# EAGLE design shell_2 (EAGLE 6.6.0)
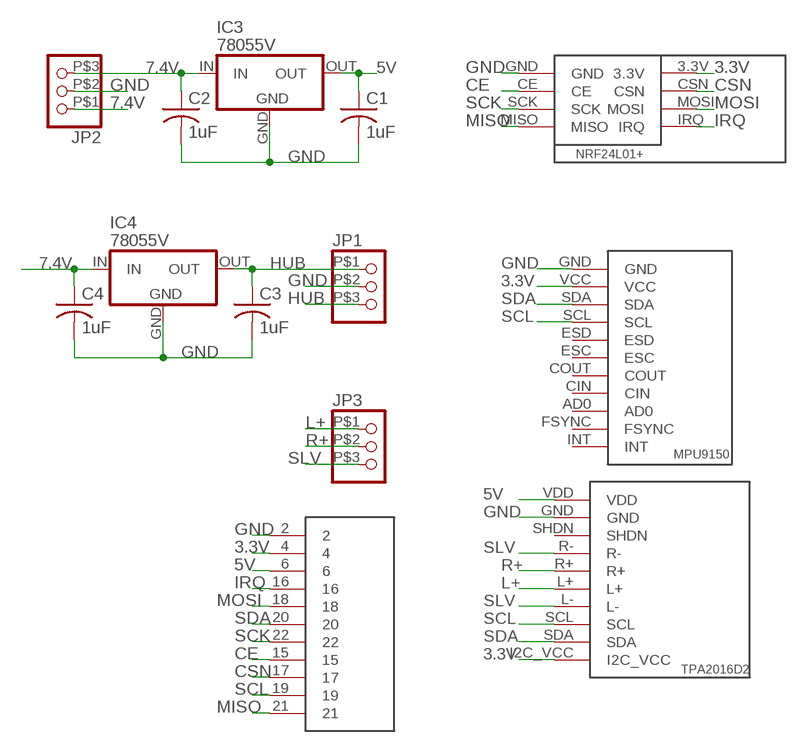
[diagram p0: schematic, sheet 1]

## Parts
C1  1uF  C-US050-024X044  [C050-024X044]
C2  1uF  C-US050-024X044  [C050-024X044]
C3  1uF  C-US050-024X044  [C050-024X044]
C4  1uF  C-US050-024X044  [C050-024X044]
IC3  78055V  [TO220H]
IC4  78055V  [TO220H]
JP1  PINHD-1X3SMD  [1X3/90SMD]
JP2  PINHD-1X3SMD  [1X3/90SMD]
JP3  PINHD-1X3SMD  [1X3/90SMD]
JP4  PINHD-1X11SMD  [1X11/90_2]
U$1  MPU9150  [MPU9150]
U$2  NRF24L01  [NRF24L01]
U$3  TPA2016D2  [TPA2016D2]

## Nets
3.3V: JP4.4 U$1.VCC U$2.3.3V U$3.I2C_VCC
5V: C1.1 IC3.OUT JP4.6 U$3.VDD
7.4V: C2.1 C4.1 IC3.IN IC4.IN JP2.P$1 JP2.P$3
CE: JP4.15 U$2.CE
CSN: JP4.17 U$2.CSN
GND: C1.2 C2.2 C3.2 C4.2 IC3.GND IC4.GND JP1.P$2 JP2.P$2 JP4.2 U$1.GND U$2.GND U$3.GND
HUB: C3.1 IC4.OUT JP1.P$1 JP1.P$3
IRQ: JP4.16 U$2.IRQ
L+: JP3.P$1 U$3.L+
MISO: JP4.21 U$2.MISO
MOSI: JP4.18 U$2.MOSI
R+: JP3.P$2 U$3.R+
SCK: JP4.22 U$2.SCK
SCL: JP4.19 U$1.SCL U$3.SCL
SDA: JP4.20 U$1.SDA U$3.SDA
SLV: JP3.P$3 U$3.L- U$3.R-
Unconnected: U$1.AD0 U$1.CIN U$1.COUT U$1.ESC U$1.ESD U$1.FSYNC U$1.INT U$3.SHDN

## Library data of the parts
C1-C4 = rcl:C-US: CAPACITOR, American symbol
IC3 IC4 = apro:78*: Positive VOLTAGE REGULATOR Source: http://cache.national.com/ds/LM/LM78L05.pdf http://www.fairchildsemi.com/ds/LM/LM7805.pdf
JP1-JP3 = apro:PINHD-1X3: PIN HEADER
JP4 = apro:PINHD-1X11: PIN HEADER
U$1 = apro:MPU9150
U$2 = apro:NRF24L01
U$3 = apro:TPA2016D2

## Board
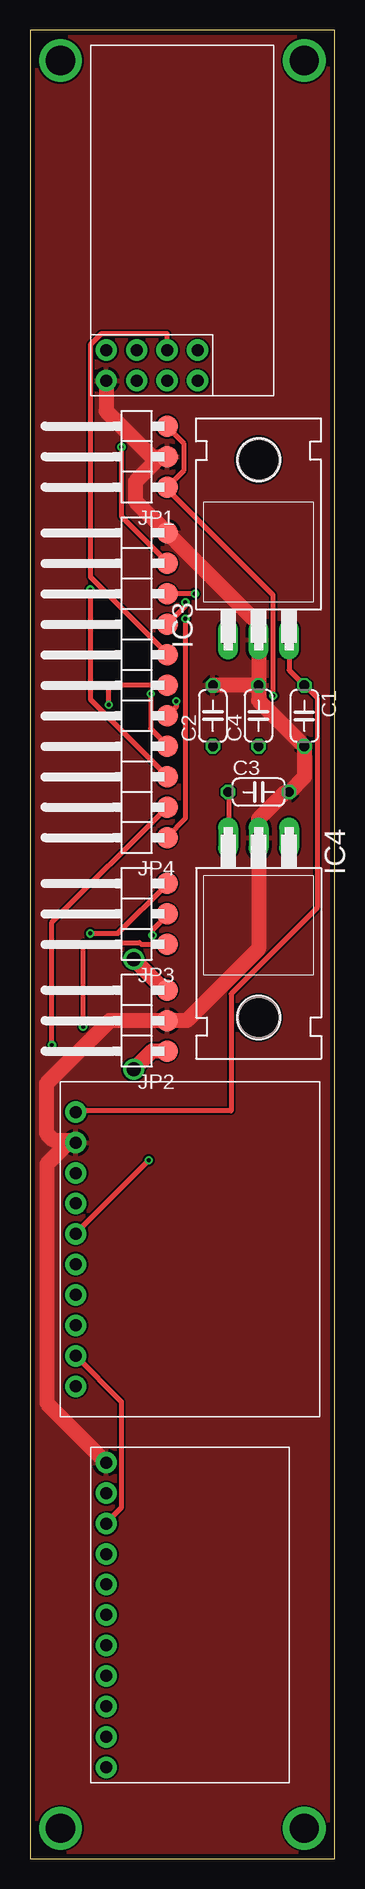
[diagram p1: board, top side]
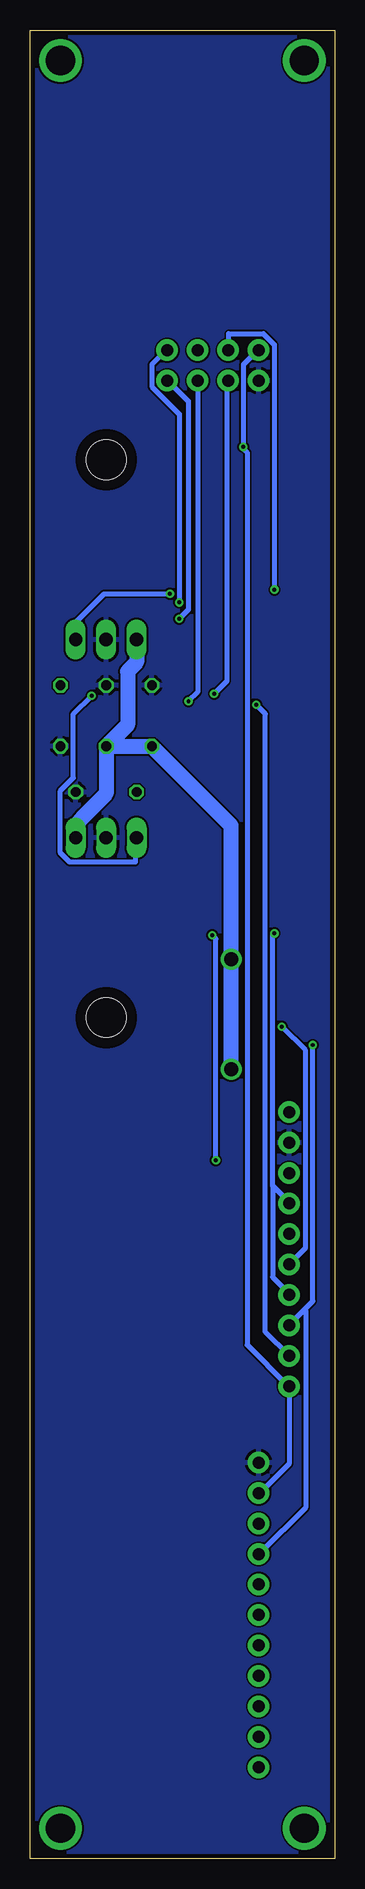
[diagram p2: board, bottom side, seen from below]

Size 25.4 x 152.4 mm. Coordinates in mm from the lower left corner, seen from the top.
Outline: 0,0 25.4,0 25.4,152.4 0,152.4 0,0
Copper layers (1*16): Top 0.0356mm / dielectric 1.5011mm / Bottom 0.0356mm
Design rules "LaenPCBOrder *": minimum track width 16mil, minimum drill 13mil, track to track 6mil, track to pad 6mil, pad to pad 6mil, via to via 6mil, smd to smd 6mil, copper to edge 15mil, drill to drill 6mil, minimum pad ring 7mil, minimum via ring 7mil, stop-mask expansion 3mil, vias tented up to drill 0mil, thermal gap 10mil

### Footprints (pad centres in the part's own frame; a part is rotated, then mirrored left to right if it is on the bottom)
C050-024X044 = drill 0.813 octagon: 1 -2.54,0; 2 2.54,0
TO220H = drill 1.118 long: GND 0,-10.16; IN -2.54,-10.16; OUT 2.54,-10.16 | hole 3.302: 0,4.826
1X3/90SMD = smd 1.778 x 1.778: P$1 -2.54,-2.54; P$2 0,-2.54; P$3 2.54,-2.54
1X11/90_2 = smd 1.778 x 1.778: 2 11.43,-2.54; 4 8.89,-2.54; 6 6.35,-2.54; 15 -6.35,-2.54; 16 3.81,-2.54; 17 -8.89,-2.54; 18 1.27,-2.54; 19 -11.43,-2.54; 20 -1.27,-2.54; 21 -13.97,-2.54; 22 -3.81,-2.54
MPU9150 = drill 1 pad 1.778: AD0 -7.62,-7.62; CIN -7.62,-5.08; COUT -7.62,-2.54; ESC -7.62,0; ESD -7.62,2.54; FSYNC -7.62,-10.16; GND -7.62,12.7; INT -7.62,-12.7; SCL -7.62,5.08; SDA -7.62,7.62; VCC -7.62,10.16
NRF24L01 = drill 1 pad 1.778: 3.3V 1.27,3.81; CE -1.27,1.27; CSN 1.27,1.27; GND -1.27,3.81; IRQ 1.27,-3.81; MISO -1.27,-3.81; MOSI 1.27,-1.27; SCK -1.27,-1.27
TPA2016D2 = drill 1 pad 1.778: GND -10.16,8.89; I2C_VCC -10.16,-11.43; L+ -10.16,-1.27; L- -10.16,-3.81; R+ -10.16,1.27; R- -10.16,3.81; SCL -10.16,-6.35; SDA -10.16,-8.89; SHDN -10.16,6.35; VDD -10.16,11.43

### Placement (x,y rotation side)
C1  22.86,95.25 270 top
C2  15.24,95.25 90 top
C3  19.05,88.9 0 top
C4  19.05,95.25 90 top
IC3  19.05,111.76 0 top
IC4  19.05,74.93 180 top
JP1  8.89,116.84 90 top
JP2  8.89,69.85 90 top
JP3  8.89,78.74 90 top
JP4  8.89,99.06 90 top
U$1  13.97,20.32 0 top
U$2  10.16,124.46 90 top
U$3  13.97,50.8 0 top

### Tracks (layer width: path | path; a pad name or v marks a point on that pad's centre or on a via)
3.3V  (via drill 0.33)
  Top 0.406: v7.62,117.65 7.62,111.86 11.43,108.05 JP4.4
  Bottom 0.406: U$1.VCC 6.25,30.48 3.81,32.92 U$3.I2C_VCC 3.96,39.47 7.32,42.82 7.32,117.2 7.62,117.5 v7.62,117.65 7.62,124.51 6.4,125.73 U$2.3.3V
5V  (via drill 0.33 pad 0.69)
  Top 0.406: IC3.OUT 21.59,99.06 C1.1 23.01,97.69 23.93,96.77 23.93,79.25 16.76,72.08 16.76,62.33 3.81,62.33 U$3.VDD | v13.74,105.41 JP4.6
  Bottom 0.406: IC3.OUT 21.59,103.05 19.23,105.41 v13.74,105.41
7.4V  (via drill 1.17 pad 1.52)
  Top 1.27: 11.12,72.39 JP2.P$3 11.23,72.39 v8.64,74.98 | JP2.P$1 10.16,67.31 v8.64,65.79
  Bottom 1.27: IC3.IN 16.51,99.72 17.27,98.96 17.27,94.49 C4.1 | C4.1 C2.1 8.64,86.11 v8.64,74.98 v8.64,65.79 | C4.1 19.05,88.77 20.98,86.84 20.98,86.82 21.69,86.11 21.69,85.19 IC4.IN
CE  (via drill 0.33)
  Top 0.406: v10.06,97.08 10.06,94.18 11.43,92.81 JP4.15
  Bottom 0.406: v10.06,97.08 8.99,98.15 8.99,123.14 U$2.CE
CSN  (via drill 0.33)
  Top 0.406: v5.03,105.77 5.03,96.62 11.43,90.22 JP4.17
  Bottom 0.406: v5.03,105.77 5.03,126.19 5.94,127.1 8.84,127.1 8.84,125.73 U$2.CSN
GND
  Top 1.27: C4.2 C2.2 | U$2.GND 6.35,120.65 10.16,116.84 JP1.P$2 10.87,116.84 8.79,114.76 8.79,113.13 JP4.2 19.05,102.87 IC3.GND C4.2 | C4.2 19.05,96.52 C1.2 22.86,90.17 C3.2 21.29,88.9 19.02,86.64 19.02,85.11 IC4.GND 19.05,75.82 13.08,69.85 JP2.P$2 6.63,69.85 1.37,64.59 1.37,60.48 1.96,59.89 3.61,59.89 U$3.GND 3.2,59.69 1.4,57.89 1.4,37.97 U$1.GND
  pour Bottom: -2.54,154.94 27.94,154.94 27.94,-2.54 -2.54,-2.54
  pour Top: -2.54,154.94 27.94,154.94 27.94,-2.54 -2.54,-2.54
HUB  (via drill 0.33)
  Top 0.406: JP1.P$3 11.43,119.33 12.8,117.96 12.8,115.67 JP1.P$1 11.43,114.15 20.27,105.31 v20.27,96.93 | C3.1 16.61,88.85 16.61,85.19 IC4.OUT
  Bottom 0.406: v20.27,96.93 21.79,95.4 21.79,90.07 22.86,89 22.86,83.82 22.1,83.06 16.61,83.06 16.61,85.04 IC4.OUT
IRQ  (via drill 0.33)
  Top 0.406: JP4.16 12.95,104.39 v12.95,104.7
  Bottom 0.406: v12.95,104.7 12.95,120.4 15.24,122.68 15.24,124.51 14.02,125.73 U$2.IRQ
L+  (via drill 0.33)
  Top 0.406: JP3.P$1 9.3,76.2 9.14,76.35 4.42,76.35 v4.42,69.34
  Bottom 0.406: v4.42,69.34 2.44,67.36 2.44,50.9 U$3.L+
MISO  (via drill 0.33)
  Top 0.406: v12.95,103.33 12.95,86.72 11.43,85.19 JP4.21
  Bottom 0.406: v12.95,103.33 12.19,104.09 12.19,121.46 13.87,123.14 U$2.MISO
MOSI
  Top 0.406: U$2.MOSI 11.43,127.1 5.94,127.1 5.03,126.19 5.03,106.83 11.43,100.43 JP4.18
N$1  (via drill 2.44 pad 3.56)
  other vias: 22.86,149.86
N$2  (via drill 2.44 pad 3.56)
  other vias: 2.54,149.86
N$3  (via drill 2.44 pad 3.56)
  other vias: 22.86,2.54
N$4  (via drill 2.44 pad 3.56)
  other vias: 2.54,2.54
R+  (via drill 0.33)
  Top 0.406: v10.21,76.96 10.21,77.42 11.43,78.64 JP3.P$2 | v9.91,58.22 3.81,52.12 U$3.R+
  Bottom 0.406: v10.21,76.96 9.91,76.66 v9.91,58.22
SCK  (via drill 0.33)
  Top 0.406: JP4.22 12.19,96.01 v12.19,96.47
  Bottom 0.406: v12.19,96.47 11.43,97.23 U$2.SCK
SCL  (via drill 0.33)
  Top 0.406: JP4.19 1.83,78.03 v1.83,67.82
  Bottom 0.406: v1.83,67.82 1.83,46.48 2.52,45.8 | 2.52,45.8 3.81,44.5 U$3.SCL | U$1.SCL 6.25,25.45 2.44,29.26 2.44,45.72 2.52,45.8
SDA  (via drill 0.33)
  Top 0.406: v6.55,96.16 6.55,97.84 11.43,97.84 JP4.20 | U$3.SDA 7.62,38.1 7.62,29.26 6.4,28.04 U$1.SDA
  Bottom 0.406: v6.55,96.16 5.79,95.4 5.79,43.89 U$3.SDA
SLV  (via drill 0.33)
  Top 0.406: v5.03,77.11 7.32,77.11 11.43,81.23 JP3.P$3
  Bottom 0.406: v5.03,77.11 5.18,76.96 5.18,56.08 | 5.18,56.08 3.81,54.71 U$3.R- | 5.18,56.08 5.18,48.46 3.81,47.09 U$3.L-